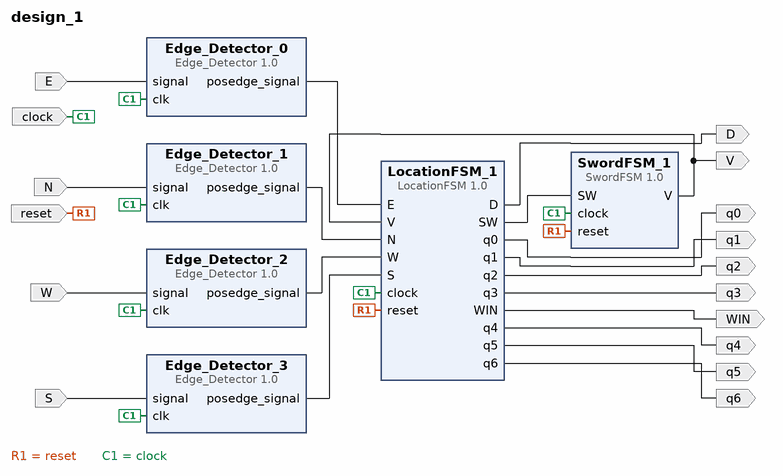
[diagram p0: block diagram of the top level]
# Vivado block design design_1, xc7a100tcsg324-1, Vivado 2019.2
create_bd_design design_1

create_bd_port -dir I clock
create_bd_port -dir I reset
create_bd_port -dir I N
create_bd_port -dir I S
create_bd_port -dir I E
create_bd_port -dir I W
create_bd_port -dir O V
create_bd_port -dir O q3
create_bd_port -dir O q2
create_bd_port -dir O q1
create_bd_port -dir O q0
create_bd_port -dir O WIN
create_bd_port -dir O q5
create_bd_port -dir O D
create_bd_port -dir O q4
create_bd_port -dir O q6

create_bd_cell -type ip -vlnv asu.edu:user:Edge_Detector:1.0 Edge_Detector_0
create_bd_cell -type ip -vlnv asu.edu:user:Edge_Detector:1.0 Edge_Detector_1
create_bd_cell -type ip -vlnv asu.edu:user:Edge_Detector:1.0 Edge_Detector_2
create_bd_cell -type ip -vlnv asu.edu:user:Edge_Detector:1.0 Edge_Detector_3
create_bd_cell -type ip -vlnv xilinx.com:user:SwordFSM:1.0 SwordFSM_1
create_bd_cell -type ip -vlnv xilinx.com:user:LocationFSM:1.0 LocationFSM_1

# ---- connections ----

connect_bd_net [get_bd_ports reset] [get_bd_pins SwordFSM_1/reset] [get_bd_pins LocationFSM_1/reset]
connect_bd_net [get_bd_ports clock] \
  [get_bd_pins Edge_Detector_0/clk] [get_bd_pins Edge_Detector_1/clk] [get_bd_pins Edge_Detector_3/clk] \
  [get_bd_pins Edge_Detector_2/clk] [get_bd_pins SwordFSM_1/clock] [get_bd_pins LocationFSM_1/clock]
connect_bd_net -net SwordFSM_0_V [get_bd_pins SwordFSM_1/V] [get_bd_ports V] [get_bd_pins LocationFSM_1/V]
connect_bd_net [get_bd_ports E] [get_bd_pins Edge_Detector_0/signal]
connect_bd_net [get_bd_ports N] [get_bd_pins Edge_Detector_1/signal]
connect_bd_net [get_bd_ports S] [get_bd_pins Edge_Detector_3/signal]
connect_bd_net [get_bd_ports W] [get_bd_pins Edge_Detector_2/signal]
connect_bd_net [get_bd_pins Edge_Detector_0/posedge_signal] [get_bd_pins LocationFSM_1/E]
connect_bd_net [get_bd_pins Edge_Detector_1/posedge_signal] [get_bd_pins LocationFSM_1/N]
connect_bd_net [get_bd_pins Edge_Detector_3/posedge_signal] [get_bd_pins LocationFSM_1/S]
connect_bd_net [get_bd_pins Edge_Detector_2/posedge_signal] [get_bd_pins LocationFSM_1/W]
connect_bd_net [get_bd_pins LocationFSM_1/D] [get_bd_ports D]
connect_bd_net [get_bd_pins LocationFSM_1/SW] [get_bd_pins SwordFSM_1/SW]
connect_bd_net [get_bd_pins LocationFSM_1/WIN] [get_bd_ports WIN]
connect_bd_net [get_bd_pins LocationFSM_1/q0] [get_bd_ports q0]
connect_bd_net [get_bd_pins LocationFSM_1/q1] [get_bd_ports q1]
connect_bd_net [get_bd_pins LocationFSM_1/q2] [get_bd_ports q2]
connect_bd_net [get_bd_pins LocationFSM_1/q3] [get_bd_ports q3]
connect_bd_net [get_bd_pins LocationFSM_1/q4] [get_bd_ports q4]
connect_bd_net [get_bd_pins LocationFSM_1/q5] [get_bd_ports q5]
connect_bd_net [get_bd_pins LocationFSM_1/q6] [get_bd_ports q6]

validate_bd_design
save_bd_design
